# Altium project UprightAccelerationController.PrjPCB
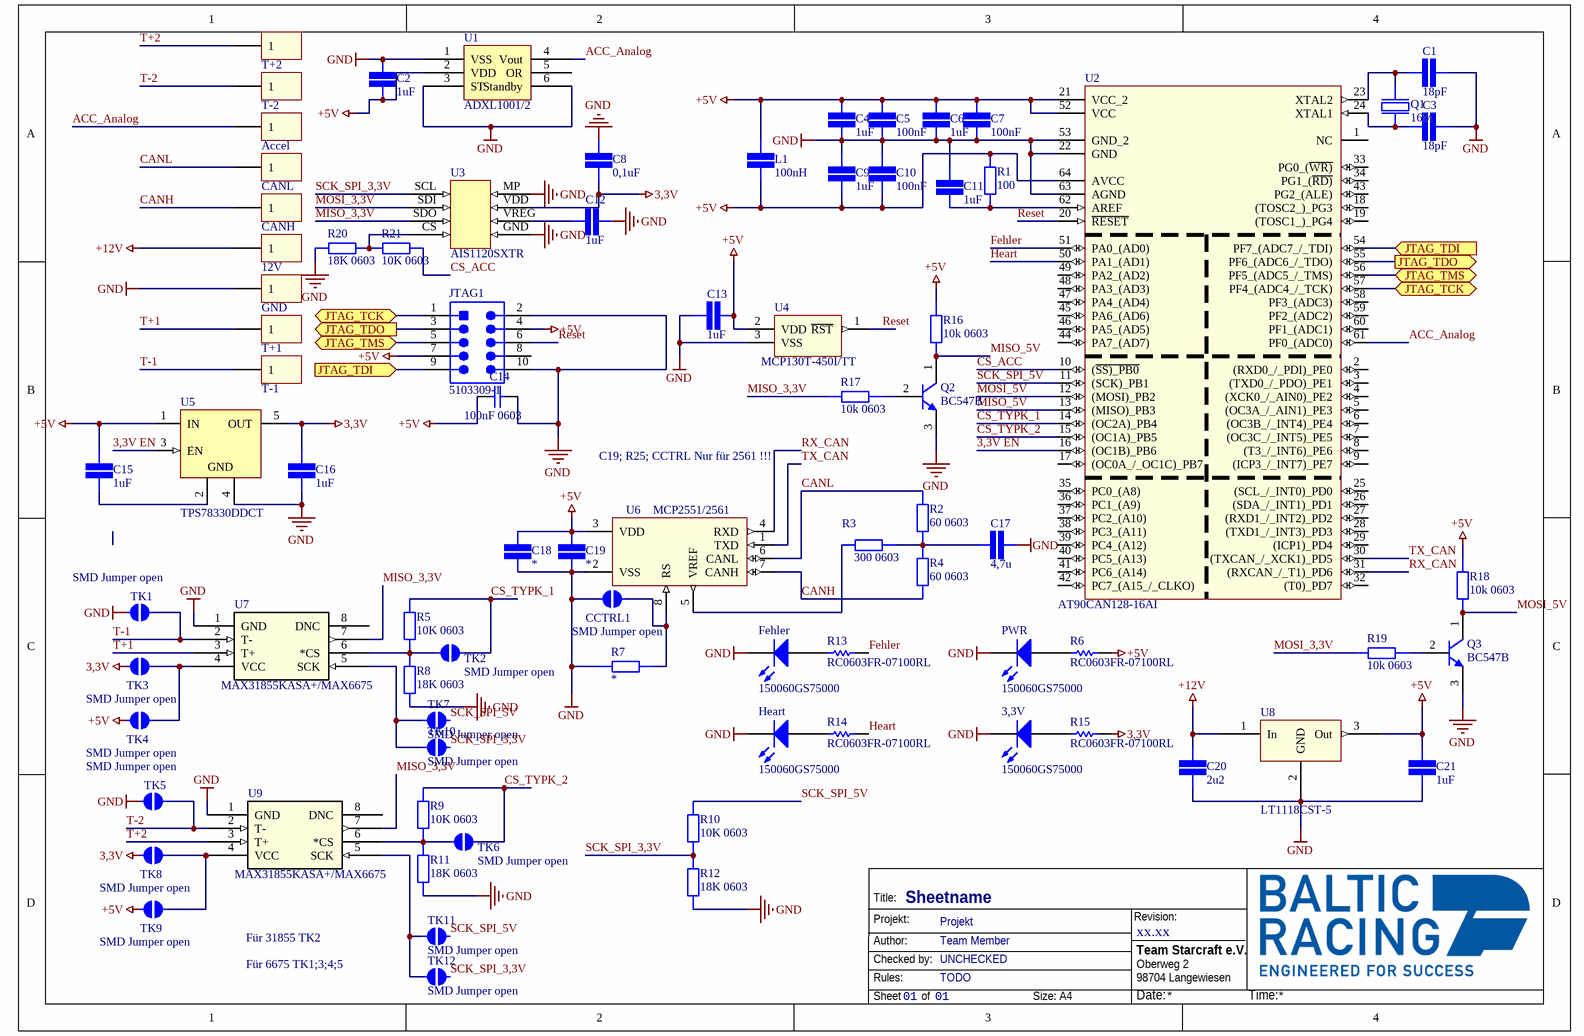
[diagram p0: main.SchDoc]
1 sheet, 82 parts. Net scope: flat (ports and power ports of the same name join across sheets).
Board files: UAC.PcbDoc, UAC_V1_1.PcbDoc, Copy of UAC_V1_1.PcbDoc

## Sheet main.SchDoc: Sheetname
size A4; Date: 05.10.2017; CheckedBy: UNCHECKED; Author: Team Member; Organization: Team Starcraft e.V.; Address1: Oberweg 2; Address2: 98704 Langewiesen; Revision: xx.xx; SheetNumber: 01; SheetTotal: 01; Rules: TODO; ProjectName: Projekt

### Parts
3,3V  150060GS75000  [0603_A]
12V  61300111121  [61300111121]  (value not drawn)
Accel  61300111121  [61300111121]  (value not drawn)
C1  value 18pF  [CAP 0603/1608]  (hidden comment: SMD Capacitor)
C2  value 1uF  [CAP 0603/1608]  (hidden comment: SMD Capacitor)
C3  value 18pF  [CAP 0603/1608]  (hidden comment: SMD Capacitor)
C4  value 1uF  [CAP 0603/1608]  (hidden comment: SMD Capacitor)
C5  value 100nF  [CAP 0603/1608]  (hidden comment: SMD Capacitor)
C6  value 1uF  [CAP 0603/1608]  (hidden comment: SMD Capacitor)
C7  value 100nF  [CAP 0603/1608]  (hidden comment: SMD Capacitor)
C8  value 0,1uF  [CAP 0603/1608]  (hidden comment: SMD Capacitor)
C9  value 1uF  [CAP 0603/1608]  (hidden comment: SMD Capacitor)
C10  value 100nF  [CAP 0603/1608]  (hidden comment: SMD Capacitor)
C11  value 1uF  [CAP 0603/1608]  (hidden comment: SMD Capacitor)
C12  value 1uF  [CAP 0603/1608]  (hidden comment: SMD Capacitor)
C13  value 1uF  [CAP 0603/1608]  (hidden comment: SMD Capacitor)
C14  100nF 0603  [CAPC0603(1608)100_L]
C15  value 1uF  [CAP 0603/1608]  (hidden comment: SMD Capacitor 1uF)
C16  value 1uF  [CAP 0603/1608]  (hidden comment: SMD Capacitor 1uF)
C17  value 4,7u  [CAP 0603/1608]  (hidden comment: SMD Capacitor)
C18  SMD Capacitor  [CAP 0603/1608]  (value not drawn)
C19  SMD Capacitor  [CAP 0603/1608]  (value not drawn)
C20  value 2u2  [CAP 0603/1608]  (hidden comment: SMD Capacitor)
C21  value 1uF  [CAP 0603/1608]  (hidden comment: SMD Capacitor)
CANH  61300111121  [61300111121]  (value not drawn)
CANL  61300111121  [61300111121]  (value not drawn)
CCTRL1  SMD Jumper open  [SMD-JUMPER-OPEN]  (no BOM)
Fehler  150060GS75000  [0603_A]
GND  61300111121  [61300111121]  (value not drawn)
Heart  150060GS75000  [0603_A]
JTAG1  5103309-1  [TECO-5103309-1_V]
L1  value 100nH  [CAP 0603/1608]  (hidden comment: SMD Capacitor)
PWR  150060GS75000  [0603_A]
Q1  16M  [NDK NX5032GA]
Q2  BC547B  [ONSC-TO-92-3-29-11]
Q3  BC547B  [ONSC-TO-92-3-29-11]
R1  value 100  [STACKPOLE CSR0603]  (hidden comment: SMD Resistor)
R2  value 60 0603  [STACKPOLE CSR0603]  (hidden comment: SMD Resistor)
R3  value 300 0603  [STACKPOLE CSR0603]  (hidden comment: SMD Resistor)
R4  value 60 0603  [STACKPOLE CSR0603]  (hidden comment: SMD Resistor)
R5  value 10K 0603  [STACKPOLE CSR0603]  (hidden comment: SMD Resistor)
R6  RC0603FR-07100RL  [RESC1608X55X25ML10T15]
R7  SMD Resistor  [STACKPOLE CSR0603]  (value not drawn)
R8  value 18K 0603  [STACKPOLE CSR0603]  (hidden comment: SMD Resistor)
R9  value 10K 0603  [STACKPOLE CSR0603]  (hidden comment: SMD Resistor)
R10  value 10K 0603  [STACKPOLE CSR0603]  (hidden comment: SMD Resistor)
R11  value 18K 0603  [STACKPOLE CSR0603]  (hidden comment: SMD Resistor)
R12  value 18K 0603  [STACKPOLE CSR0603]  (hidden comment: SMD Resistor)
R13  RC0603FR-07100RL  [RESC1608X55X25ML10T15]
R14  RC0603FR-07100RL  [RESC1608X55X25ML10T15]
R15  RC0603FR-07100RL  [RESC1608X55X25ML10T15]
R16  value 10k 0603  [STACKPOLE CSR0603]  (hidden comment: SMD Resistor)
R17  value 10k 0603  [STACKPOLE CSR0603]  (hidden comment: SMD Resistor)
R18  value 10k 0603  [STACKPOLE CSR0603]  (hidden comment: SMD Resistor)
R19  value 10k 0603  [STACKPOLE CSR0603]  (hidden comment: SMD Resistor)
R20  value 18K 0603  [STACKPOLE CSR0603]  (hidden comment: SMD Resistor)
R21  value 10K 0603  [STACKPOLE CSR0603]  (hidden comment: SMD Resistor)
T+1  61300111121  [61300111121]  (value not drawn)
T+2  61300111121  [61300111121]  (value not drawn)
T-1  61300111121  [61300111121]  (value not drawn)
T-2  61300111121  [61300111121]  (value not drawn)
TK1  SMD Jumper open  [SMD-JUMPER-OPEN]  (no BOM)
TK2  SMD Jumper open  [SMD-JUMPER-OPEN]  (no BOM)
TK3  SMD Jumper open  [SMD-JUMPER-OPEN]  (no BOM)
TK4  SMD Jumper open  [SMD-JUMPER-OPEN]  (no BOM)
TK5  SMD Jumper open  [SMD-JUMPER-OPEN]  (no BOM)
TK6  SMD Jumper open  [SMD-JUMPER-OPEN]  (no BOM)
TK7  SMD Jumper open  [SMD-JUMPER-OPEN]  (no BOM)
TK8  SMD Jumper open  [SMD-JUMPER-OPEN]  (no BOM)
TK9  SMD Jumper open  [SMD-JUMPER-OPEN]  (no BOM)
TK10  SMD Jumper open  [SMD-JUMPER-OPEN]  (no BOM)
TK11  SMD Jumper open  [SMD-JUMPER-OPEN]  (no BOM)
TK12  SMD Jumper open  [SMD-JUMPER-OPEN]  (no BOM)
U1  ADXL1001/2  [PCBComponent_1]
U2  AT90CAN128-16AI  [*QFP80P1600X1600X120-64N]
U3  AIS1120SXTR  [SOIC8; SOIC127P600X175-8N]
U4  MCP130T-450I/TT  [*SOT95P237X112-3N]
U5  TPS78330DDCT  [DDC0005A_L]
U6  MCP2551/2561  [*SOIC127P600X175-8N]
U7  MAX31855KASA+/MAX6675  [SOIC8]
U8  LT1118CST-5  [*SOT230P700X180-4N]
U9  MAX31855KASA+/MAX6675  [SOIC8]

### Ports
JTAG_TCK (bidir), JTAG_TDI (in), JTAG_TDO (out), JTAG_TMS (bidir)

### Nets
3,3V: C8.1 C16.2 R15.1 TK3.1 TK8.1 U3.VDD U5.5(OUT)
+5V: C2.1 C4.2 C5.2 C6.2 C7.2 C9.1 C10.1 C13.1 C14.1 C15.2 C18.2 C19.2 C21.2 JTAG1.4 JTAG1.7 L1.1 L1.2 R1.2 R6.1 R16.1 R18.1 TK4.1 TK9.1 U1.2(VDD) U2.21(VCC_2) U2.52(VCC) U2.64(AVCC) U4.2(VDD) U5.1(IN) U6.3(VDD) U8.3(Out)
+12V: 12V.1 C20.2 U8.1(In)
GND: 3,3V.1(K) C1.1 C2.2 C3.1 C4.1 C5.1 C6.1 C7.1 C8.2 C9.2 C10.2 C11.2 C12.2 C13.2 C14.2 C16.1 C17.2 C18.1 C19.1 C20.1 C21.1 CCTRL1.1 Fehler.1(K) GND.1 Heart.1(K) JTAG1.2 JTAG1.10 PWR.1(K) Q2.3(E) Q3.3(E) R7.1 R8.1 R11.1 R12.1 R20.1 TK1.1 TK5.1 U1.1(VSS) U1.3(ST) U1.6(Standby) U2.22(GND) U2.53(GND_2) U2.63(AGND) U3.GND U3.MP U4.3(VSS) U5.4(GND) U6.2(VSS) U7.1(GND) U8.2(GND) U9.1(GND)
3,3V EN: U2.16((OC1B)_PB6) U5.3(EN)
ACC_Analog: Accel.1 U1.4(Vout) U2.61(PF0_(ADC0))
CANH: CANH.1 R4.2 U6.7(CANH)
CANL: CANL.1 R2.1 U6.6(CANL)
CS_ACC: R21.2 U2.10((~{SS)_PB0})
CS_TYPK_1: R5.2 TK2.2 U2.14((OC2A)_PB4)
CS_TYPK_2: R9.2 TK6.2 U2.15((OC1A)_PB5)
Fehler: R13.1 U2.51(PA0_(AD0))
Heart: R14.1 U2.50(PA1_(AD1))
MISO_3,3V: R17.1 U3.SDO U7.7(SO) U9.7(SO)
MISO_5V: Q2.1(C) R16.2 U2.13((MISO)_PB3)
MOSI_3,3V: R19.1 U3.SDI
MOSI_5V: Q3.1(C) R18.2 U2.12((MOSI)_PB2)
Reset: JTAG1.6 U2.20(~{RESET}) U4.1(~{RST})
RX_CAN: U2.31((RXCAN_/_T1)_PD6) U6.4(RXD)
SCK_SPI_3,3V: R10.1 R12.2 TK10.1 TK12.1 U3.SCL
SCK_SPI_5V: R10.2 TK7.1 TK11.1 U2.11((SCK)_PB1)
T+1: T+1.1 U7.3(T+)
T+2: T+2.1 U9.3(T+)
T-1: T-1.1 TK1.2 U7.2(T-)
T-2: T-2.1 TK5.2 U9.2(T-)
TX_CAN: U2.30((TXCAN_/_XCK1)_PD5) U6.1(TXD)
Net3,3V_2: 3,3V.2(A) R15.2
NetC1_2: C1.2 Q1.2 U2.23(XTAL2)
NetC3_2: C3.2 Q1.1 U2.24(XTAL1)
NetC11_1: C11.1 R1.1 U2.62(AREF)
NetC12_1: C12.1 U3.VREG
NetC15_1: C15.1 U5.2(GND)
NetC17_1: C17.1 R2.2 R3.2 R4.1
NetCCTRL1_2: CCTRL1.2 R7.2 U6.8(RS)
NetFehler_2: Fehler.2(A) R13.2
NetHeart_2: Heart.2(A) R14.2
NetJTAG1_1: JTAG1.1 U2.57(PF4_(ADC4_/_TCK)) ; port JTAG_TCK
NetJTAG1_3: JTAG1.3 U2.55(PF6_(ADC6_/_TDO)) ; port JTAG_TDO
NetJTAG1_5: JTAG1.5 U2.56(PF5_(ADC5_/_TMS)) ; port JTAG_TMS
NetJTAG1_9: JTAG1.9 U2.54(PF7_(ADC7_/_TDI)) ; port JTAG_TDI
NetPWR_2: PWR.2(A) R6.2
NetQ2_2: Q2.2(B) R17.2
NetQ3_2: Q3.2(B) R19.2
NetR3_1: R3.1 U6.5(VREF)
NetR5_1: R5.1 R8.2 TK2.1 U7.6(*CS)
NetR9_1: R9.1 R11.2 TK6.1 U9.6(*CS)
NetR20_2: R20.2 R21.1 U3.CS
NetTK3_2: TK3.2 TK4.2 U7.4(VCC)
NetTK7_2: TK7.2 TK10.2 U7.5(SCK)
NetTK8_2: TK8.2 TK9.2 U9.4(VCC)
NetTK11_2: TK11.2 TK12.2 U9.5(SCK)

Not connected (* = marked no-connect by the designer): JTAG1 8; U1 5(OR); U2 1(NC) 2((RXD0_/_PDI)_PE0) 3((TXD0_/_PDO)_PE1) 4((XCK0_/_AIN0)_PE2) 5((OC3A_/_AIN1)_PE3) 6((OC3B_/_INT4)_PE4) 7((OC3C_/_INT5)_PE5) 8((T3_/_INT6)_PE6) 9((ICP3_/_INT7)_PE7) 17((OC0A_/_OC1C)_PB7) 18((TOSC2_)_PG3) 19((TOSC1_)_PG4) 25((SCL_/_INT0)_PD0) 26((SDA_/_INT1)_PD1) 27((RXD1_/_INT2)_PD2) 28((TXD1_/_INT3)_PD3) 29((ICP1)_PD4) 32((T0)_PD7) 33(PG0_(~{WR)}) 34(PG1_(~{RD)}) 35(PC0_(A8)) 36(PC1_(A9)) 37(PC2_(A10)) 38(PC3_(A11)) 39(PC4_(A12)) 40(PC5_(A13)) 41(PC6_(A14)) 42(PC7_(A15_/_CLKO)) 43(PG2_(ALE)) 44(PA7_(AD7)) 45(PA6_(AD6)) 46(PA5_(AD5)) 47(PA4_(AD4)) 48(PA3_(AD3)) 49(PA2_(AD2)) 58(PF3_(ADC3)) 59(PF2_(ADC2)) 60(PF1_(ADC1)); U7 8(DNC); U9 8(DNC)

### Notes on the sheet
- C19; R25; CCTRL Nur für 2561 !!!
- Für 31855 TK2
- Für 6675 TK1;3;4;5
- Title:
- Projekt:
- Revision:
- Author:
- Rules:
- Checked by:
- Sheet
- of
- Size:
- A4
- Date:
- Time:

### Library data of the parts
3,3V Fehler Heart PWR = CMP-1426-00002-1: SMD mono-color Chip LED, WL-SMCW, Green; Manufacturer: Wuerth Elektronik; ComponentLink1URL: http://www.we-online.com; ComponentLink2Description: Datasheet; Color: Green; ComponentLink2URL: http://katalog.we-online.com/led/datasheet/150060GS75000.pdf; PartNumber: 150060GS75000; PackageReference: 0603_A; ComponentLink1Description: Manufacturer URL
12V Accel CANH CANL GND T+1 T+2 T-1 T-2 = 61300111121: WR-PHD 2.54 mm THT Pin Header, 1p; Pin Number: 1; Rated Current: 3 A; Working Voltage: 250 VAC; Withstanding Voltage: 500 VAC; Pitch: 2.54 mm; ComponentLink1Description: Manufacturer; ComponentLink1URL: http://www.we-online.de; ComponentLink2Description: Datasheet; ComponentLink2URL: http://katalog.we-online.de/em/datasheet/6130xx11121.pdf; Part Number: 61300111121; Published Date: Aug 2017; Publisher: Wurth Elektronik
C1-C13 C15-C21 L1 = SMD Capacitor: Capacitor with multiple Footprints
  C18 C19: Value: *
C14 = CMP-1035-02579-1: CAP 100nF 10V ±5% 0603 (1608 Metric) Thickness 1mm SMD; Tolerance: Â±5%; Case-EIA: 0603; Case-Metric: 1608; Value: 100nF; Max Thickness: 1 mm; Rated Voltage: 10 V; Technology: SMT
JTAG1 = CMP-2000-07502-1: Male Header, Pitch 2.54 mm, 2 x 5 Position, Height 9.855 mm, Tail Length 3.048 mm, -65 to 105 degC, RoHS, Tube; Manufacturer: TE Connectivity; PCB Mounting Orientation: Vertical; Pitch: 2.54mm; Mating Connector Lock: No(Without); Body Material: Thermoplastic; Shrouded: Yes(With); Connector System: Wire-to-Board; Insulation Resistance: 5GR; Number of Positions: 10; Max Current Rating: 1A; PCB Mount Retention: Without; Manufacturer URL: http://www.te.com/; Contact Plating: Gold; Datasheet URL: http://www.te.com/commerce/DocumentDelivery/DDEController?Action=showdoc&DocId=Customer+Drawing%7F5103309%7FE1%7Fpdf%7FEnglish%7FENG_CD_5103309_E1.pdf%7F5103309-1; Colour: Black; Termination: ThroughHole; Housing Colour: Black; Flammability Rating: UL94V-0; Package Description: Male Header, Pitch 2.54 mm, 2 x 5 Position, Height 9.855 mm, Tail Length 3.048 mm; Mating Retention: No(Without); Orientation: Straight; Row Spacing: 2.54mm; Termination Post Length: 0.12inch; Min Operating Temperature: -65degC; Board Standoff: Yes(With); REACH SVHC: NoSVHC; Depth: 9.14mm; Lead Free: LeadFree; Gender: Male; Connector Type: Header; Shrouded End Dimension: 3.81mm; ELV: Compliant; Mating Alignment: Yes(With); Panel Mount Retention: No(Without); Package Quantity: 35; PCB Mount Alignment: No(Without); Number of Rows: 2; Package Reference: 5103309-1; Mounting Technology: ThroughHole; Mount: ThroughHole; Contact Gender: Male; Number of Contacts: 10; Length: 0.8inch; Current Rating: 1A; Contact Mating Length: 0.24inch; Max Operating Temperature: 105degC; RoHSCompliant: True; Datasheet Version: Rev. E1, 03/2011; Contact Shape: Square; Height: 8.813mm; Housing Material: PBT; Contact Material: CopperAlloy; Packaging: Rail/Tube
Q1 = 16 MHz Quartz
Q2 Q3 = CMP-1048-01467-1: Amplifier Transistor, NPN Silicon, 3-Pin TO-92, Bulk Box; Manufacturer: On Semiconductor; IC Continuous (A): 0.1; fT Min (MHz): 150; DatasheetVersion: Rev. 7; ComponentLink1URL: http://www.onsemi.com/; Polarity: NPN; RoHS: FALSE; ComponentLink1Description: Manufacturer URL; Packing: Bulk Box; PackageDescription: 3-Pin Transistor Outline, Body 4.825 x 3.685 mm, Pitch 1.27 mm; ComponentLink3URL: http://www.onsemi.cn/pub_link/Collateral/2N6426-D.PDF; ComponentLink2Description: Datasheet; PackageVersion: Rev. AM; PackageReference: TO-92-3-29-11_AM_SL; ComponentLink3Description: Package Specification; Mounting Technology: Through Hole; PartNumber: BC547B; ComponentLink2URL: http://www.onsemi.com/pub_link/Collateral/BC546-D.PDF
R1-R5 R7-R12 R16-R21 = SMD Resistor: Resistor with multiple footprints
  R7: Value: *
R6 R13-R15 = CMP-2100-03663-1: Chip Resistor, 100 Ohm, +/- 1%, 0.1 W, -55 to 155 degC, 0603 (1608 Metric), RoHS, Tape and Reel; Manufacturer: Yageo; Voltage Rating (DC): 50V; Power Rating: 100mW; Resistance: 100Ohm; Temperature Coefficient: 100ppm/degreesC; Number of Pins: 2; Tolerance: 1%; Height: 0.45mm; Manufacturer URL: http://www.yageo.com/; Military Standard: Not; Datasheet URL: http://www.yageo.com/NewPortal/yageodocoutput?fileName=/pdf/R-Chip/PYu-RC_Group_51_RoHS_L_5.pdf; Case Code (Imperial): 0603; Termination: SMD/SMT; Lead Free: LeadFree; Max Operating Temperature: 155degC; Case Code (Metric): 1608; RoHSCompliant: true; Voltage Rating: 50V; Width: 0.8mm; Composition: ThickFilm; Depth: 0.8mm; REACH SVHC: Unknown; Min Operating Temperature: -55degC; Packaging: TapeandReel; Package Description: 2-Pin Surface Mount Device, Body 1.6 x 0.8 mm; Length: 1.6mm; Package Reference: 0603; Datasheet Version: Rev. 5, 10/2016; Case/Package: 0603
U1 = ADXL1001/2: pin to pad: 1>13 2>12 3>16 4>30 5>20 6>15
U2 = AT90CAN128-16AI: Ic Mcu 8bit 128kb Flash 64tqfp; MF: Microchip; MP: AT90CAN128-16AI; Package: TQFP-64 Microchip; SnapEDA_Link: https://www.snapeda.com/parts/AT90CAN128-16AI/Microchip/view-part/?ref=snap; Price: None; Availability: Unavailable; Value: *
U3 = AIS1120SXTR: pin to pad: CS>4 GND>5 MP>8 SCL>1 SDI>2 SDO>3 VDD>7 VREG>6
U4 = MCP130T-450I/TT: System Supervisors - Power Supply Monitors with Reset Generators Open Drain Low; MF: Microchip; MP: MCP120T-450I/TT; Price: None; SnapEDA_Link: https://www.snapeda.com/parts/MCP120T-450I/TT/Microchip/view-part/?ref=snap; Package: SOT-23-3 Microchip; Availability: Unavailable; Value: *
U5 = CMP-0394-01077-2: Single Output LDO, 150 mA, Fixed 3 V Output, 2.2 to 5.5 V Input, with Ultra-Low IQ, 5-pin SOT (DDC), -40 to 105 degC, Green (RoHS & no Sb/Br); Manufacturer: Texas Instruments; Vout Adj(Min)(V): 3; SubFamily: Single Channel LDO; Iout(Max)(A): 0.15; Vdo(Typ)(mV): 130; Rating: Catalog; Iq(Typ)(mA): 0.0005; Vin(Min)(V): 2.2; Vin(Max)(V): 5.5; PackageDescription: 5-Pin Plastic Small Outline, Body 2.9 x 1.6 mm, 0.95 mm Pitch; ComponentLink1Description: Manufacturer URL; Code_JEDEC: MO-193; PackageVersion: 4204403-2/E; ComponentLink1URL: http://www.ti.com/; Mounting Technology: Surface Mount; ComponentLink3URL: http://www.ti.com/litv/pdf/mpds123d; ComponentLink2Description: Datasheet; ComponentLink2URL: http://www.ti.com/general/docs/lit/getliterature.tsp?genericPartNumber=TPS78330&fileType=pdf; DatasheetVersion: SBVS133; Accuracy(%): 3; ComponentLink3Description: Package Specification; Vout Adj(Max)(V): 3; PartNumber: TPS78330DDCT; PackageReference: DDC0005A; Fixed Output Options(V): 3; Eco-Plan: Green (RoHS & no Sb/Br)
U6 = MCP2551-I/SN: MCP2551 Series 5.5 V 1 Mb/s Surface Mount High-Speed CAN Transceiver - SOIC-8; MF: Microchip; MP: MCP2551-I/SN; SnapEDA_Link: https://www.snapeda.com/parts/MCP2551-I/SN/Microchip/view-part/?ref=snap; Price: None; Package: SOIC-8 Microchip; Availability: Unavailable; Value: *
U7 U9 = MAX31855KASA+: No Description Available; Vendor: Maxim Integrated Products; Built_By: EMA_UL_Team; Manufacturer_Part_Number: MAX31855KASA+; Copyright: Copyright (C) 2018 Accelerated Designs. All rights reserved; RefDes: RefDes; Type: DEV; Value: Value
U8 = LT1118CST-5: or UA78M if used topdown (in and out changed)